# EAGLE design dsplolo (EAGLE 8.0.0)

## Sheet 1 of 2
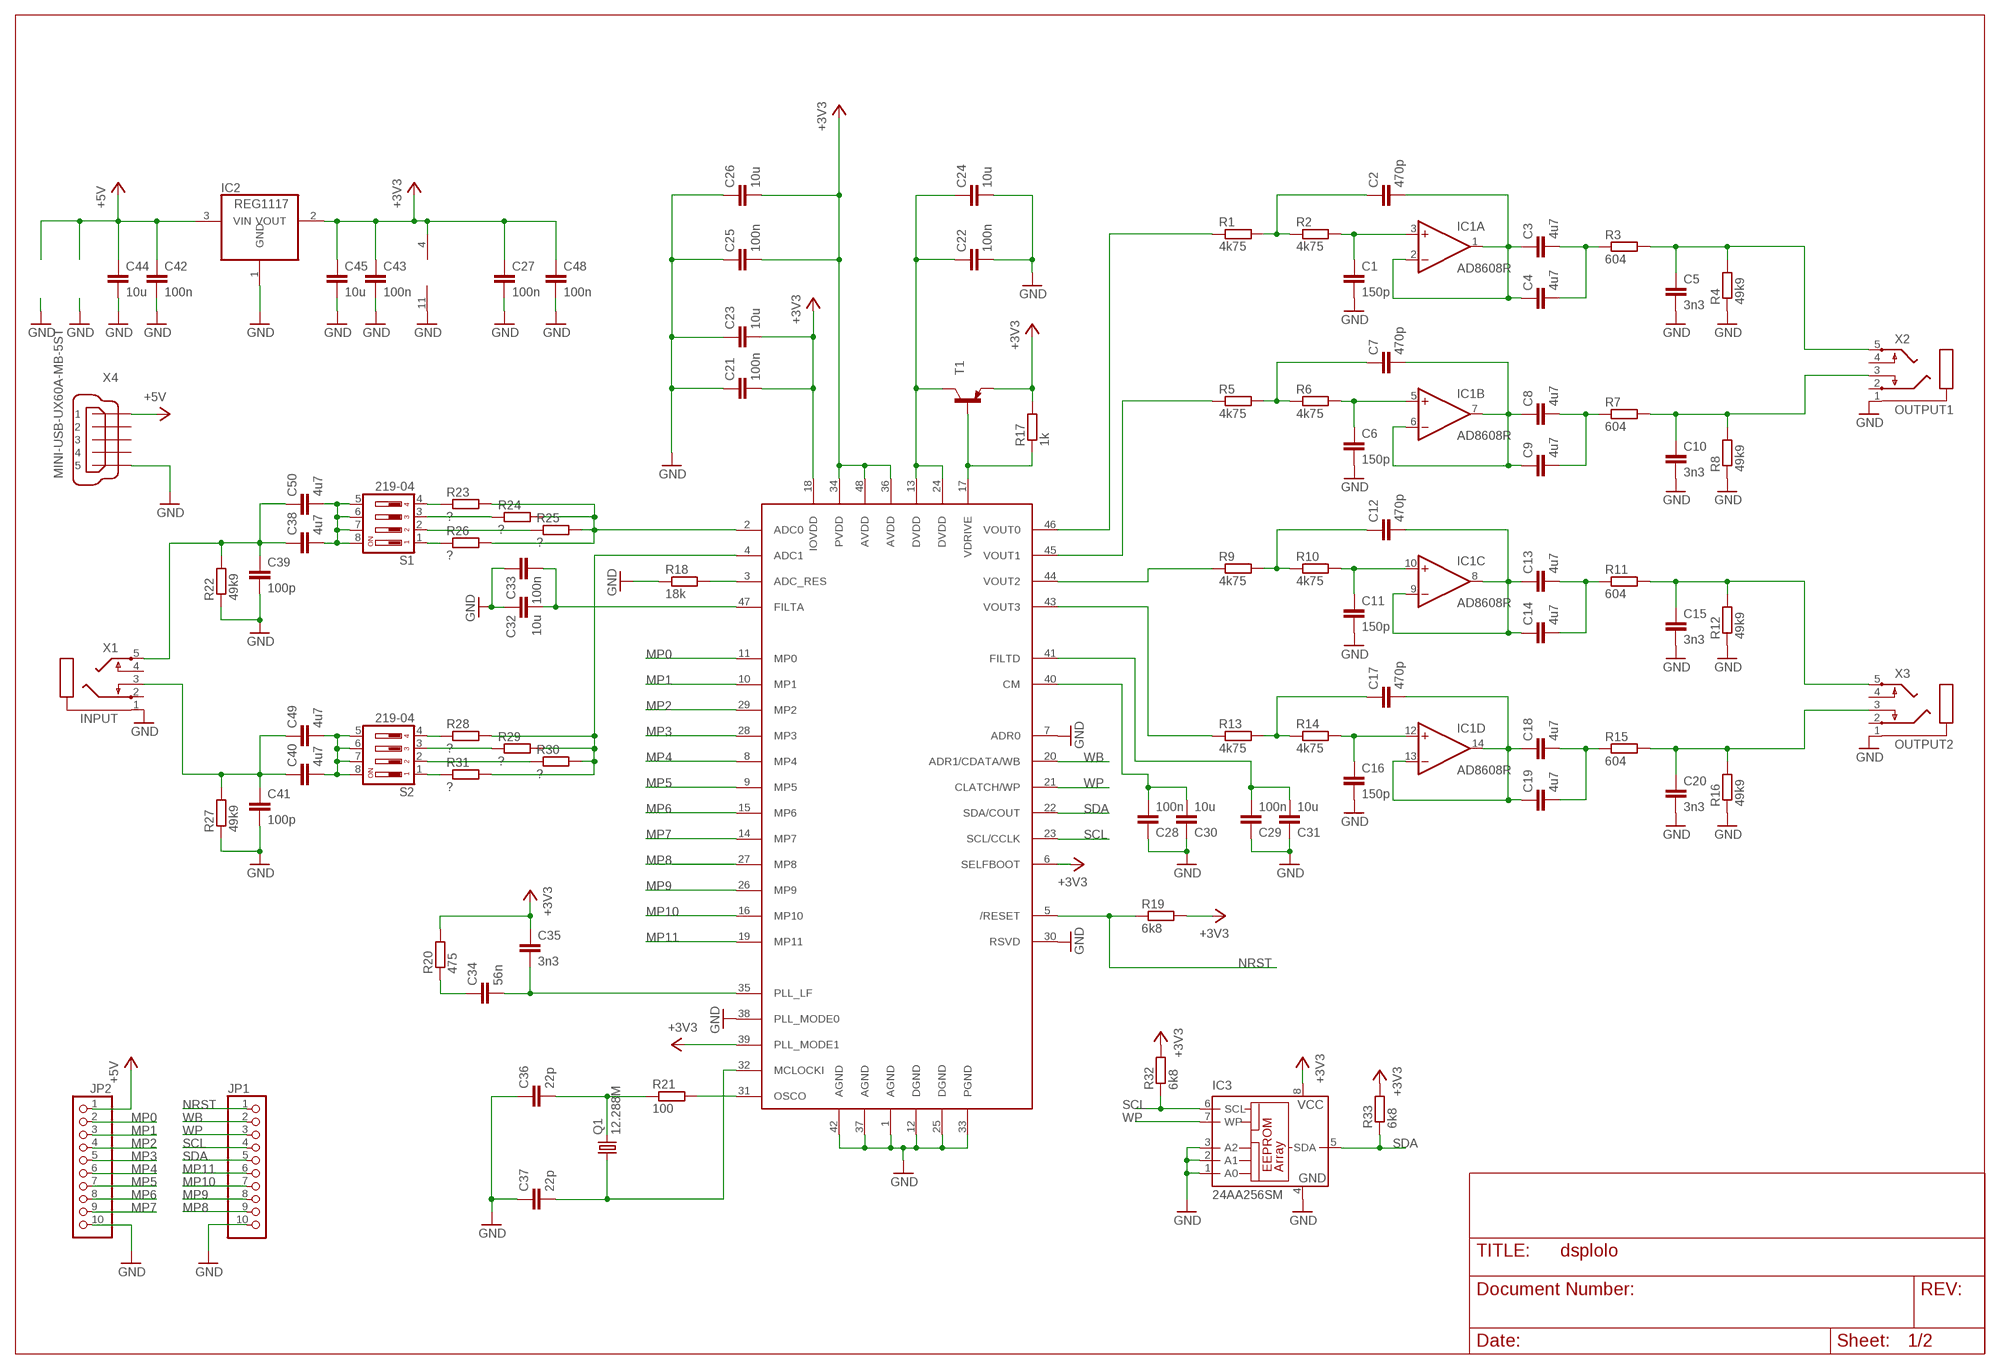
[diagram p0: schematic, sheet 1]

### Parts
C1  150p  C-EUC1206  [C1206]
C2  470p  C-EUC1206  [C1206]
C3  4u7  C-EUC1206  [C1206]
C4  4u7  C-EUC1206  [C1206]
C5  3n3  C-EUC1206  [C1206]
C6  150p  C-EUC1206  [C1206]
C7  470p  C-EUC1206  [C1206]
C8  4u7  C-EUC1206  [C1206]
C9  4u7  C-EUC1206  [C1206]
C10  3n3  C-EUC1206  [C1206]
C11  150p  C-EUC1206  [C1206]
C12  470p  C-EUC1206  [C1206]
C13  4u7  C-EUC1206  [C1206]
C14  4u7  C-EUC1206  [C1206]
C15  3n3  C-EUC1206  [C1206]
C16  150p  C-EUC1206  [C1206]
C17  470p  C-EUC1206  [C1206]
C18  4u7  C-EUC1206  [C1206]
C19  4u7  C-EUC1206  [C1206]
C20  3n3  C-EUC1206  [C1206]
C21  100n  C-EUC1206  [C1206]
C22  100n  C-EUC1206  [C1206]
C23  10u  C-EUC1206  [C1206]
C24  10u  C-EUC1206  [C1206]
C25  100n  C-EUC1206  [C1206]
C26  10u  C-EUC1206  [C1206]
C27  100n  C-EUC1206  [C1206]
C28  100n  C-EUC1206  [C1206]
C29  100n  C-EUC1206  [C1206]
C30  10u  C-EUC1206  [C1206]
C31  10u  C-EUC1206  [C1206]
C32  10u  C-EUC1206  [C1206]
C33  100n  C-EUC1206  [C1206]
C34  56n  C-EUC1206  [C1206]
C35  3n3  C-EUC1206  [C1206]
C36  22p  C-EUC1206  [C1206]
C37  22p  C-EUC1206  [C1206]
C38  4u7  C-EUC1206  [C1206]
C39  100p  C-EUC1206  [C1206]
C40  4u7  C-EUC1206  [C1206]
C41  100p  C-EUC1206  [C1206]
C42  100n  C-EUC1206  [C1206]
C43  100n  C-EUC1206  [C1206]
C44  10u  C-EUC1206  [C1206]
C45  10u  C-EUC1206  [C1206]
C48  100n  C-EUC1206  [C1206]
C49  4u7  C-EUC1206  [C1206]
C50  4u7  C-EUC1206  [C1206]
IC1  AD8608R  [SO-14]
IC2  REG1117  [SOT223]
IC3  24AA256SM  24AA128SM  [SO-08M]
JP1  PINHD-1X10  [1X10]
JP2  PINHD-1X10  [1X10]
Q1  12.288M  CRYSTALHC49UP  [HC49UP]
R1  4k75  R-EU_R1206  [R1206]
R2  4k75  R-EU_R1206  [R1206]
R3  604  R-EU_R1206  [R1206]
R4  49k9  R-EU_R1206  [R1206]
R5  4k75  R-EU_R1206  [R1206]
R6  4k75  R-EU_R1206  [R1206]
R7  604  R-EU_R1206  [R1206]
R8  49k9  R-EU_R1206  [R1206]
R9  4k75  R-EU_R1206  [R1206]
R10  4k75  R-EU_R1206  [R1206]
R11  604  R-EU_R1206  [R1206]
R12  49k9  R-EU_R1206  [R1206]
R13  4k75  R-EU_R1206  [R1206]
R14  4k75  R-EU_R1206  [R1206]
R15  604  R-EU_R1206  [R1206]
R16  49k9  R-EU_R1206  [R1206]
R17  1k  R-EU_R1206  [R1206]
R18  18k  R-EU_R1206  [R1206]
R19  6k8  R-EU_R1206  [R1206]
R20  475  R-EU_R1206  [R1206]
R21  100  R-EU_R1206  [R1206]
R22  49k9  R-EU_R1206  [R1206]
R23  ?  R-EU_R1206  [R1206]
R24  ?  R-EU_R1206  [R1206]
R25  ?  R-EU_R1206  [R1206]
R26  ?  R-EU_R1206  [R1206]
R27  49k9  R-EU_R1206  [R1206]
R28  ?  R-EU_R1206  [R1206]
R29  ?  R-EU_R1206  [R1206]
R30  ?  R-EU_R1206  [R1206]
R31  ?  R-EU_R1206  [R1206]
R32  6k8  R-EU_R1206  [R1206]
R33  6k8  R-EU_R1206  [R1206]
S1  219-04  [CTS-219-04]
S2  219-04  [CTS-219-04]
T1  BC857C-PNP-SOT23-BEC  [SOT23-BEC]
U$1  ADAU1701  [LQFP-48]
X1  INPUT  STEREOJACK  [STX3100]
X2  OUTPUT1  STEREOJACK  [STX3100]
X3  OUTPUT2  STEREOJACK  [STX3100]
X4  MINI-USB-UX60A-MB-5ST  [UX60A-MB-5ST]

### Nets
+3V3: C21.2 C23.2 C25.2 C26.2 C27.1 C35.1 C43.1 C45.1 C48.1 IC1.4(V+) IC2.2(VOUT) IC3.8(VCC) R17.2 R19.2 R20.2 R32.2 R33.2 T1.E U$1.6(SELFBOOT) U$1.18(IOVDD) U$1.34(PVDD) U$1.36(AVDD) U$1.39(PLL_MODE1) U$1.48(AVDD)
+5V: C42.1 C44.1 IC2.3(VIN) JP2.1 X4.1
GND: C1.2 C5.2 C6.2 C10.2 C11.2 C15.2 C16.2 C20.2 C21.1 C22.2 C23.1 C24.2 C25.1 C26.1 C27.2 C28.1 C29.1 C30.1 C31.1 C32.1 C33.1 C36.1 C37.1 C39.2 C41.2 C42.2 C43.2 C44.2 C45.2 C48.2 IC1.11(V-) IC2.1(GND) IC3.1(A0) IC3.2(A1) IC3.3(A2) IC3.4(GND) JP1.10 JP2.10 R4.1 R8.1 R12.1 R16.1 R18.1 R22.1 R27.1 U$1.1(AGND) U$1.7(ADR0) U$1.12(DGND) U$1.25(DGND) U$1.30(RSVD) U$1.33(PGND) U$1.37(AGND) U$1.38(PLL_MODE0) U$1.42(AGND) X1.1 X2.1 X3.1 X4.5
MP0: JP2.2 U$1.11(MP0)
MP1: JP2.3 U$1.10(MP1)
MP2: JP2.4 U$1.29(MP2)
MP3: JP2.5 U$1.28(MP3)
MP4: JP2.6 U$1.8(MP4)
MP5: JP2.7 U$1.9(MP5)
MP6: JP2.8 U$1.15(MP6)
MP7: JP2.9 U$1.14(MP7)
MP8: JP1.9 U$1.27(MP8)
MP9: JP1.8 U$1.26(MP9)
MP10: JP1.7 U$1.16(MP10)
MP11: JP1.6 U$1.19(MP11)
N$1: C8.2 C9.2 R7.1
N$2: C3.2 C4.2 R3.1
N$3: C5.1 R3.2 R4.2 X2.5
N$4: C2.1 R1.2 R2.1
N$5: C1.1 IC1.3(A:+IN) R2.2
N$6: C2.2 C3.1 C4.1 IC1.1(A:OUT) IC1.2(A:-IN)
N$7: C10.1 R7.2 R8.2 X2.3
N$8: C7.1 R5.2 R6.1
N$9: C6.1 IC1.5(B:+IN) R6.2
N$10: C7.2 C8.1 C9.1 IC1.6(B:-IN) IC1.7(B:OUT)
N$11: C13.2 C14.2 R11.1
N$12: C15.1 R11.2 R12.2 X3.5
N$13: C12.1 R9.2 R10.1
N$14: C11.1 IC1.10(C:+IN) R10.2
N$15: C12.2 C13.1 C14.1 IC1.8(C:OUT) IC1.9(C:-IN)
N$16: C18.2 C19.2 R15.1
N$17: C20.1 R15.2 R16.2 X3.3
N$18: C17.1 R13.2 R14.1
N$19: C16.1 IC1.12(D:+IN) R14.2
N$20: C17.2 C18.1 C19.1 IC1.13(D:-IN) IC1.14(D:OUT)
N$21: R18.2 U$1.3(ADC_RES)
N$22: C22.1 C24.1 T1.C U$1.13(DVDD) U$1.24(DVDD)
N$23: R17.1 T1.B U$1.17(VDRIVE)
N$24: R1.1 U$1.46(VOUT0)
N$25: R5.1 U$1.45(VOUT1)
N$26: R9.1 U$1.44(VOUT2)
N$27: R13.1 U$1.43(VOUT3)
N$28: C32.2 C33.2 U$1.47(FILTA)
N$29: C37.2 Q1.1 U$1.32(MCLOCKI)
N$30: C29.2 C31.2 U$1.41(FILTD)
N$31: C28.2 C30.2 U$1.40(CM)
N$32: C34.2 C35.2 U$1.35(PLL_LF)
N$33: C34.1 R20.1
N$34: C36.2 Q1.2 R21.1
N$35: R21.2 U$1.31(OSCO)
N$36: R23.1 S1.4
N$37: C38.1 C39.1 C50.1 R22.2 X1.5
N$38: C38.2 C50.2 S1.5 S1.6 S1.7 S1.8
N$39: R24.1 S1.3
N$40: R25.1 S1.2
N$41: R26.1 S1.1
N$42: R23.2 R24.2 R25.2 R26.2 U$1.2(ADC0)
N$44: C40.1 C41.1 C49.1 R27.2 X1.3
N$45: C40.2 C49.2 S2.5 S2.6 S2.7 S2.8
N$46: R28.1 S2.4
N$47: R29.1 S2.3
N$48: R30.1 S2.2
N$49: R31.1 S2.1
N$50: R28.2 R29.2 R30.2 R31.2 U$1.4(ADC1)
NRST: JP1.1 R19.1 U$1.5(/RESET)
SCL: IC3.6(SCL) JP1.4 R32.1 U$1.23(SCL/CCLK)
SDA: IC3.5(SDA) JP1.5 R33.1 U$1.22(SDA/COUT)
WB: JP1.2 U$1.20(ADR1/CDATA/WB)
WP: IC3.7(WP) JP1.3 U$1.21(CLATCH/WP)
Unconnected: X1.2 X1.4 X2.2 X2.4 X3.2 X3.4 X4.2 X4.3 X4.4

## Sheet 2 of 2
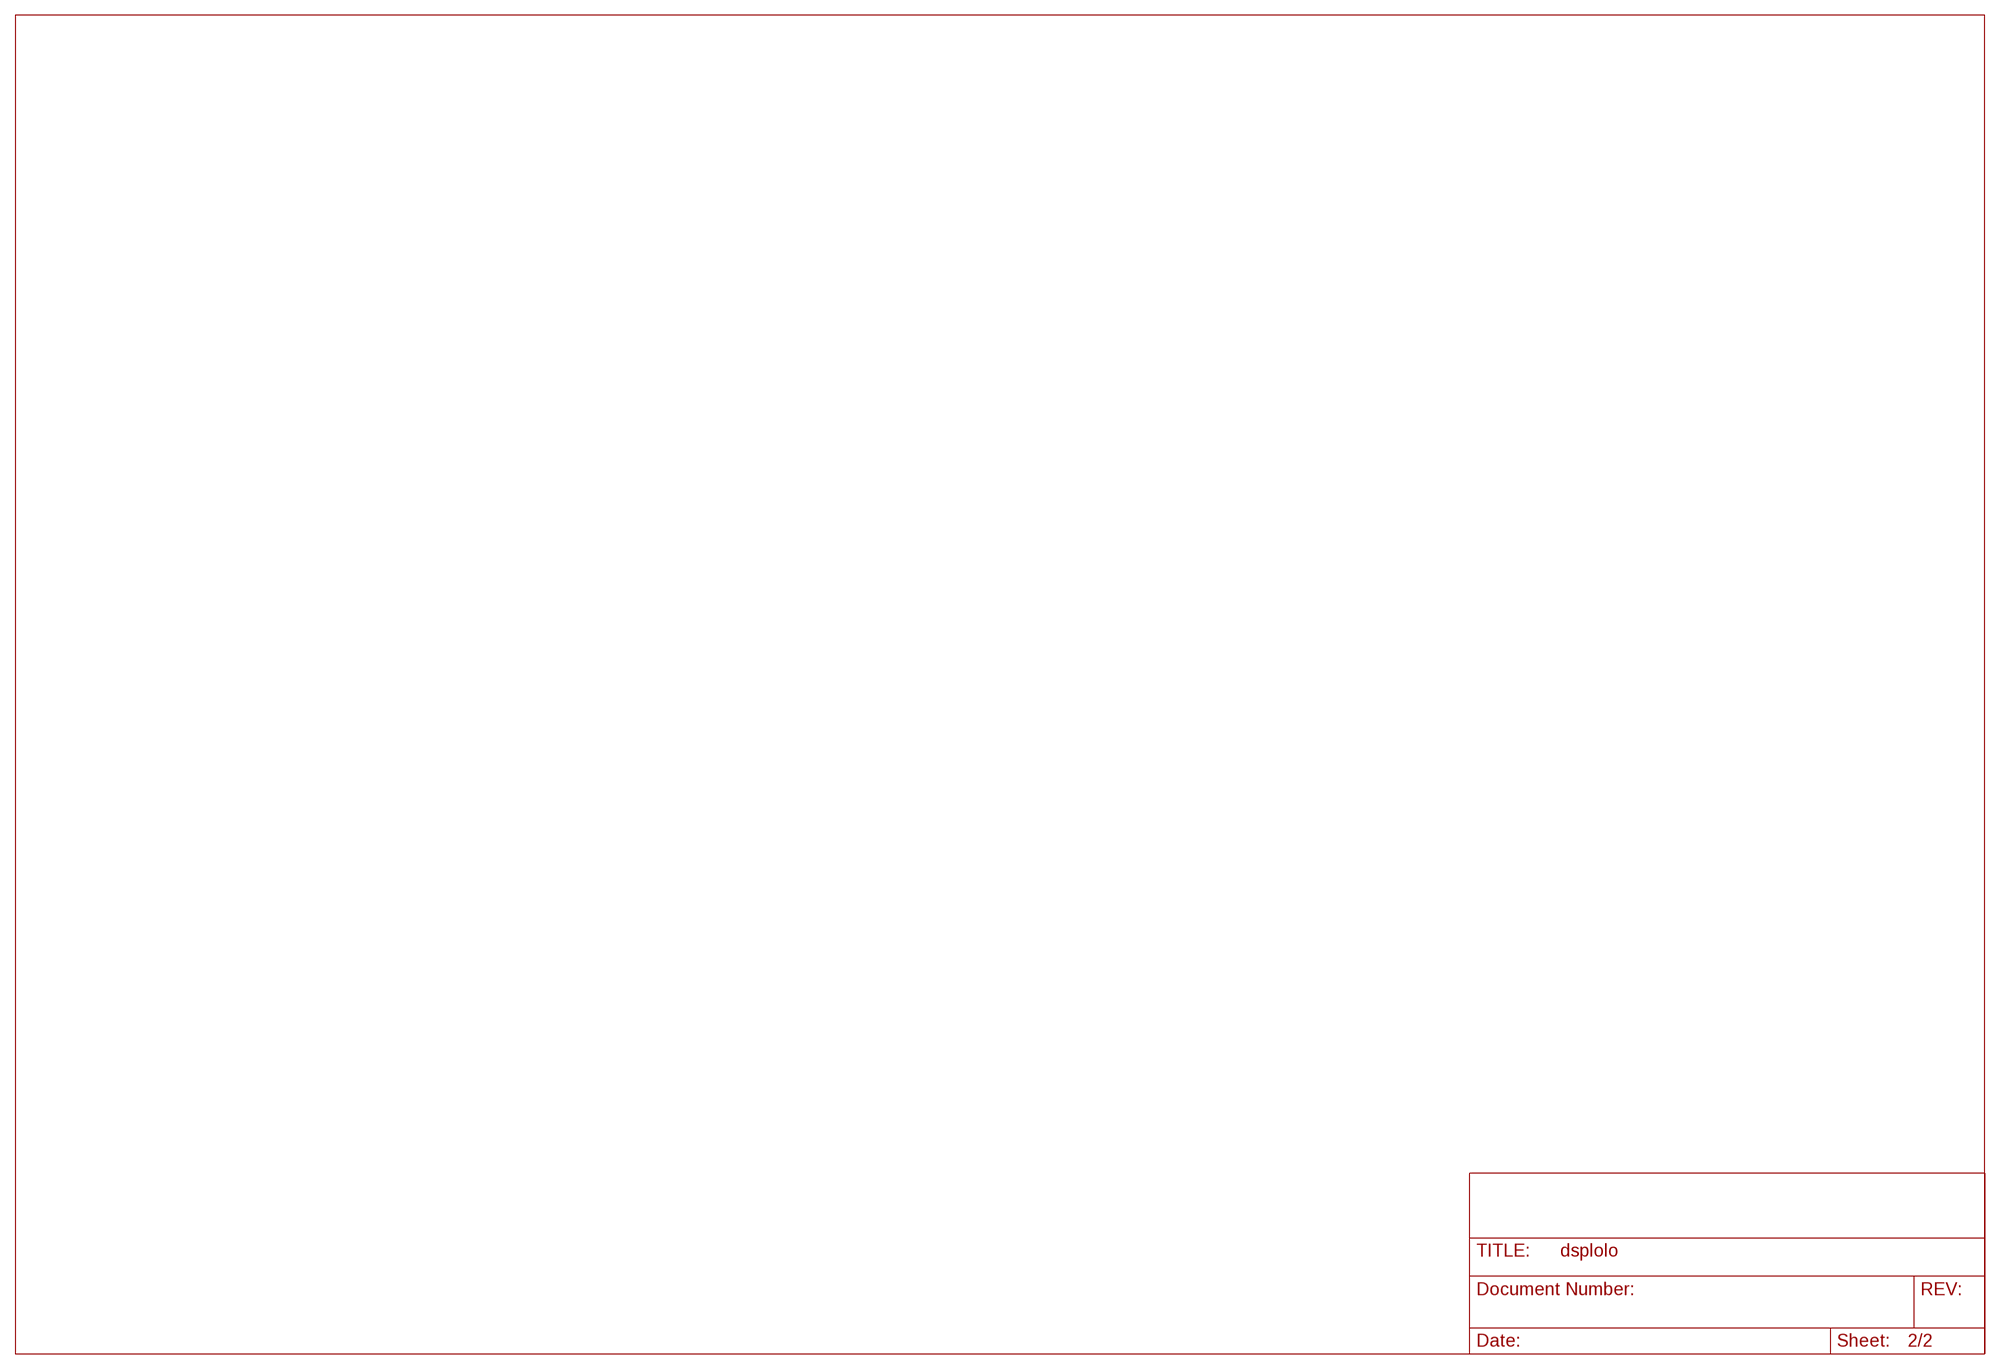
[diagram p1: schematic, sheet 2]

## Library data of the parts
C1-C20 = rcl:C-EU: CAPACITOR, European symbol
C21-C45 C48-C50 = resistor:C-EU: CAPACITOR, European symbol
IC1 = 0-ADI-variety:AD8608*
IC2 = burr-brown:REG1117: 800mA and 1A Low Dropout (LDO) Positive Regulator 1.8V, 2.5V, 2.85V, 3.3V, 5V, and Adj; MPN: REG1117; OC_FARNELL: 1097566; OC_NEWARK: 14P6981
IC3 = microchip:24*: Serial EEPROM I2C; MF: MICROCHIP; MPN: 24AA128-I/MS; OC_FARNELL: 1331285; OC_NEWARK: 92C6839
JP1 JP2 = pinhead:PINHD-1X10: PIN HEADER
Q1 = crystal:CRYSTAL: CRYSTAL; OC_FARNELL: unknown; OC_NEWARK: unknown
R1-R33 = rcl:R-EU_: RESISTOR, European symbol
S1 S2 = switch-dil:219-04*: Surface Mount DIP Switch Series 219 SMT CTS Electronic Components Sourc: www.ctscorp.com; OC_FARNELL: unknown; OC_NEWARK: unknown
T1 = transistor:*-PNP-: PNP Transistror
U$1 = analog-devices_2:ADAU1701
X1-X3 = adafruit:STEREOJACK: MIC/HEADPHONE JACK Stereo jack with two switches. Kycon STX3100, CUI SJ1-3555NG and/or 4UCon 05544
X4 = con-hirose:MINI-USB-: MINI USB Connector Source: http://www.hirose.co.jp/cataloge_hp/e24000019.pdf; OC_FARNELL: unknown; OC_NEWARK: unknown

## Board
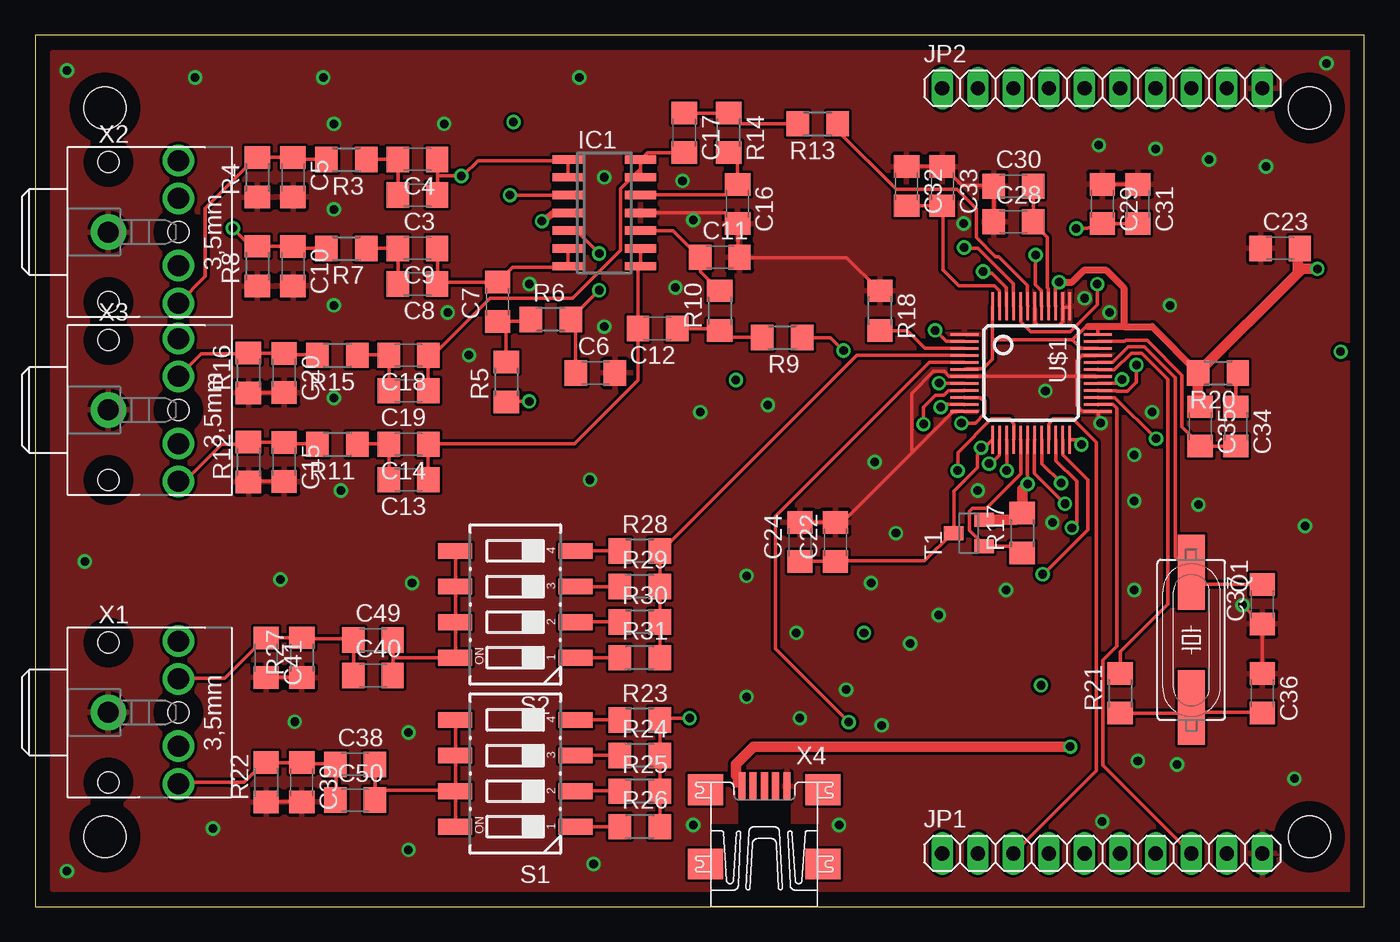
[diagram p2: board, top side]
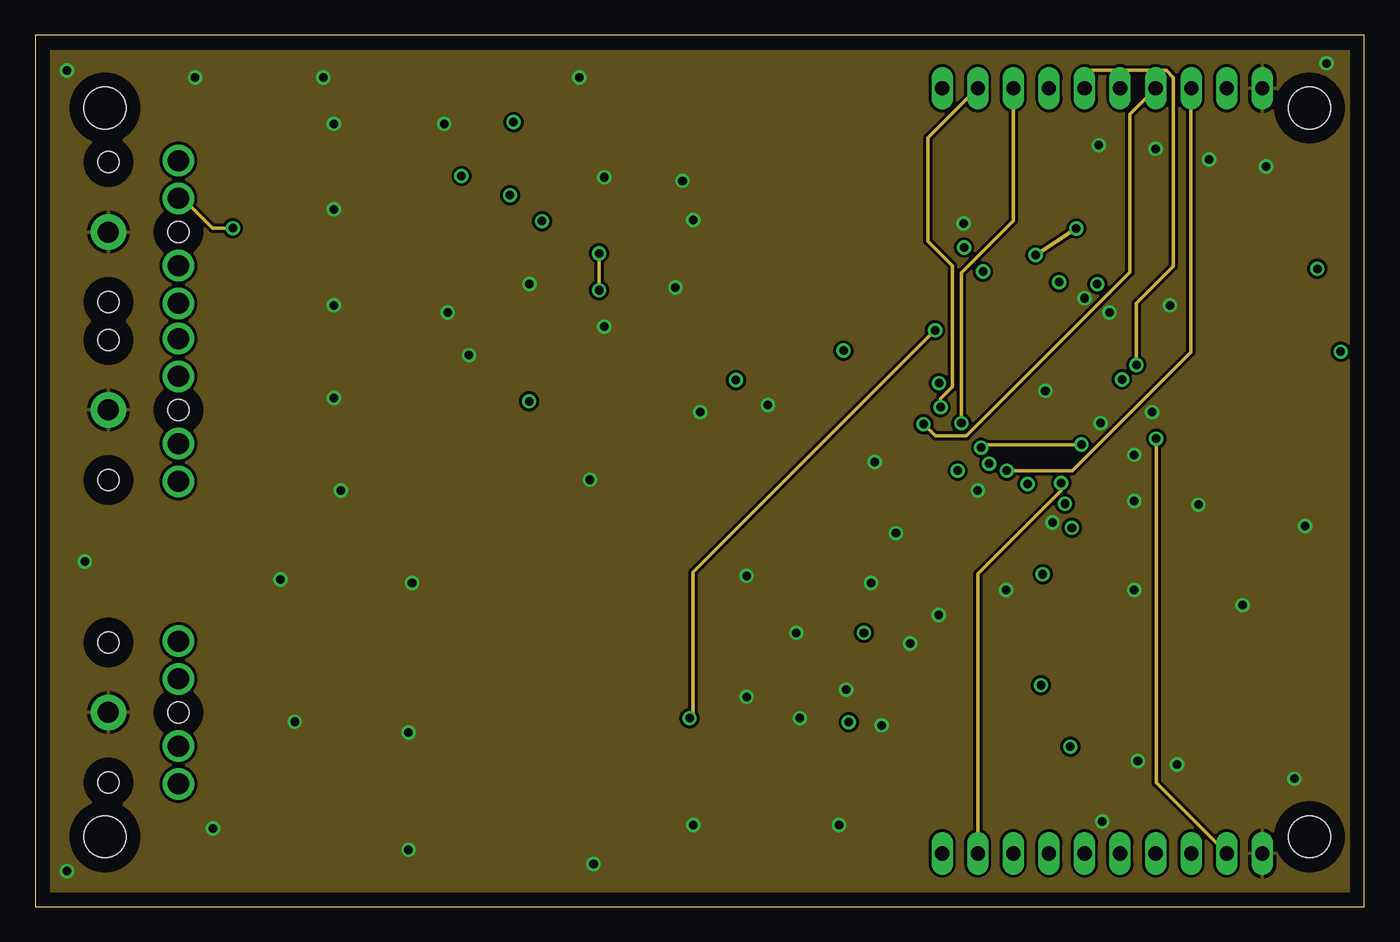
[diagram p3: board, inner layer Route2]
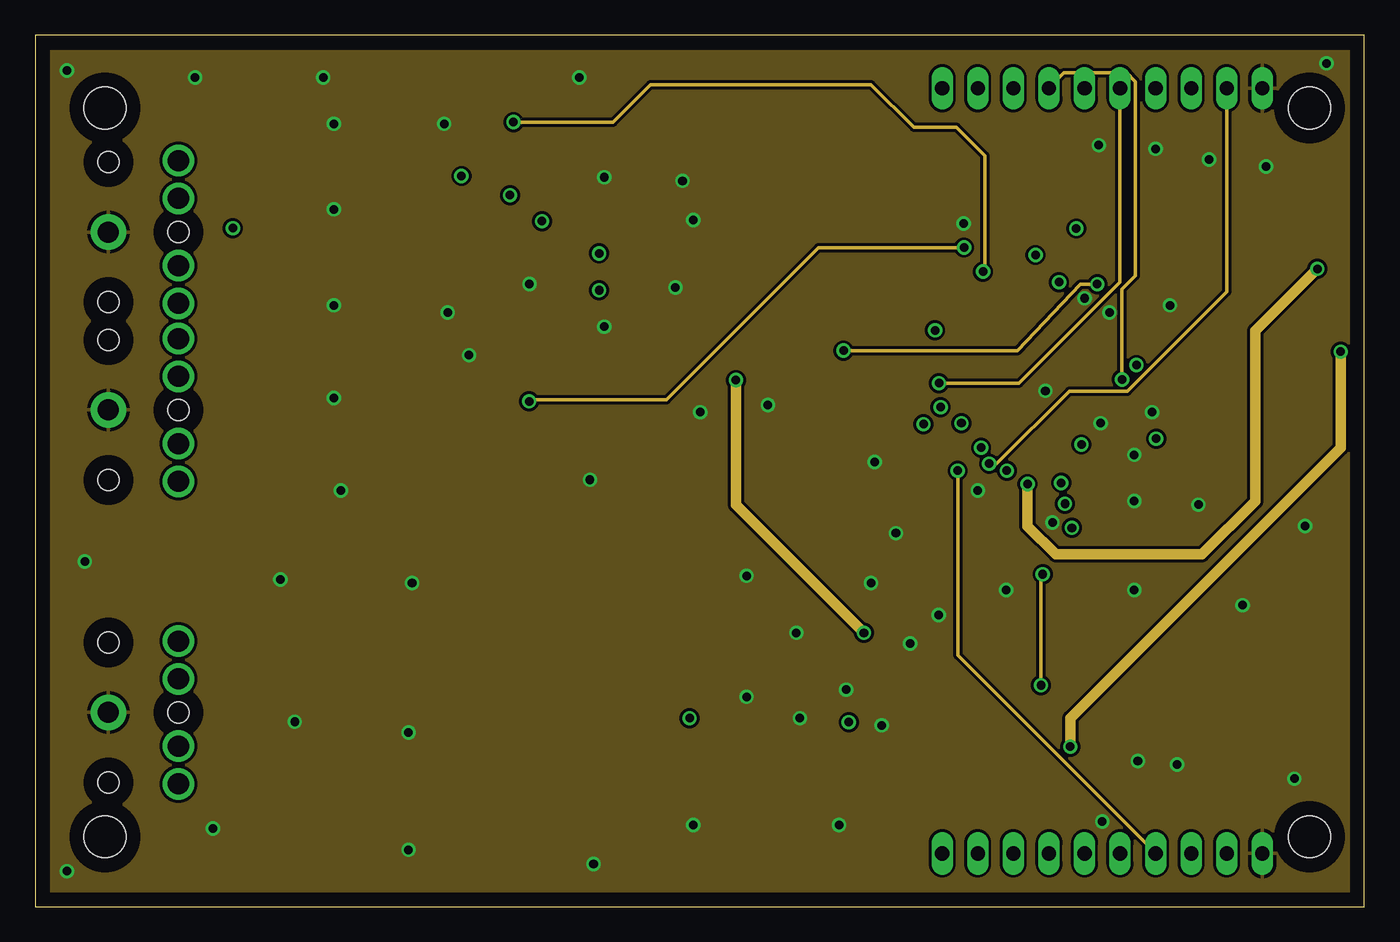
[diagram p4: board, inner layer Route15]
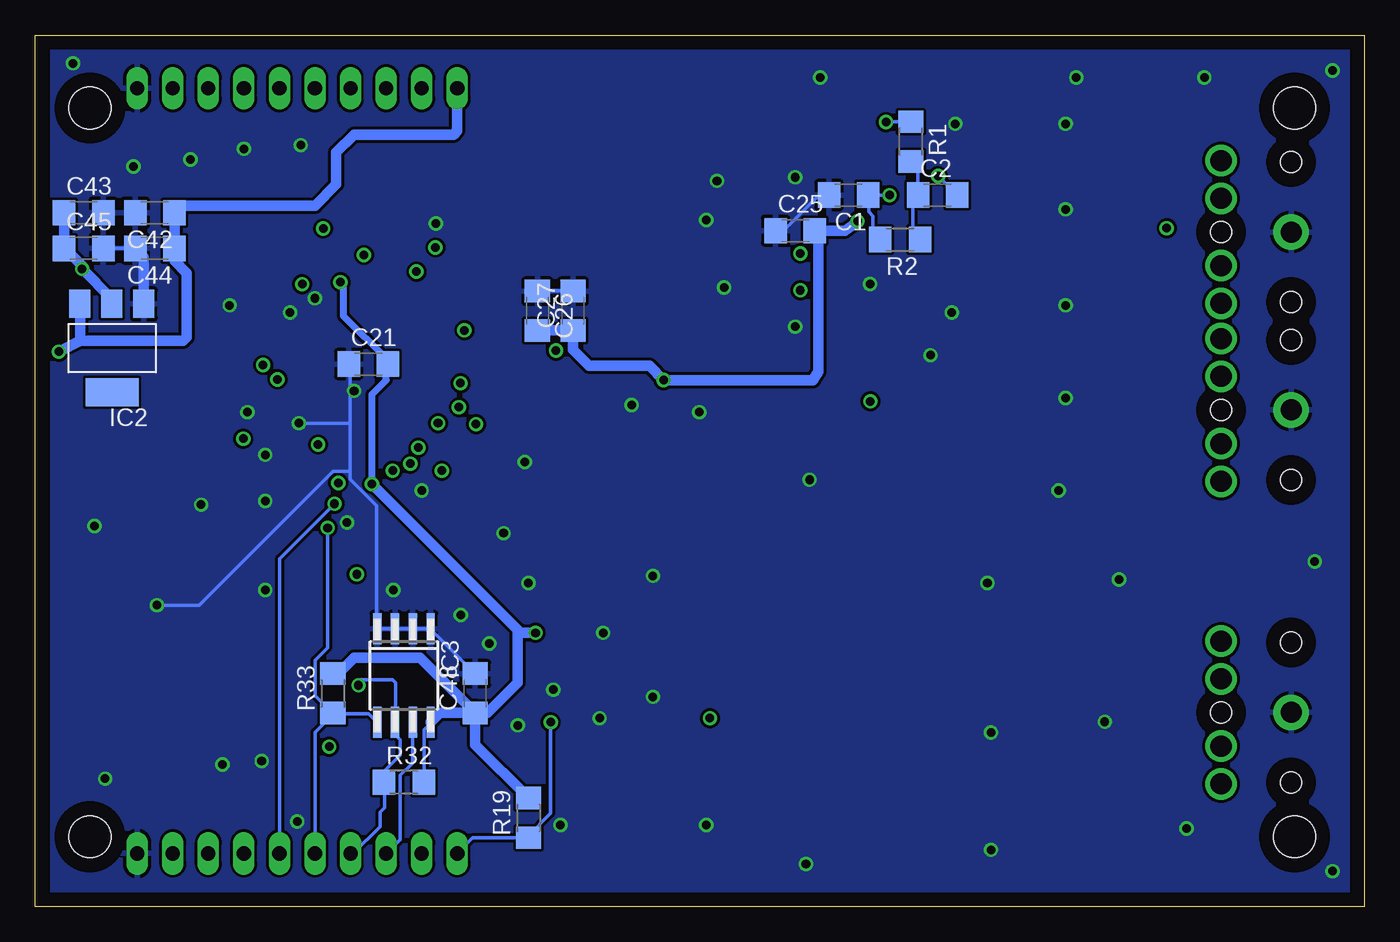
[diagram p5: board, bottom side, seen from below]

Size 94.92 x 62.22 mm. Coordinates in mm from the lower left corner, seen from the top.
Outline: 0,0 94.92,0 94.92,62.22 0,62.22 0,0
Copper layers (1*2*15*16): Top 0.018mm / dielectric 0.2mm / Route2 0.018mm / dielectric 1mm / Route15 0.018mm / dielectric 0.2mm / Bottom 0.018mm
Design rules "default *": minimum track width 10mil, minimum drill 24mil, track to track 8mil, track to pad 8mil, pad to pad 8mil, via to via 8mil, smd to smd 8mil, copper to edge 40mil, drill to drill 8mil, minimum pad ring 10mil, minimum via ring 8mil, stop-mask expansion 4mil, vias tented up to drill 0mil, thermal gap 10mil
Holes 3 mm at 5,5 5,57 91,57 91,5

### Footprints (pad centres in the part's own frame; a part is rotated, then mirrored left to right if it is on the bottom)
C1206 = smd 1.6 x 1.8: 1 -1.4,0; 2 1.4,0
SO-14 = smd 0.6 x 2.2: 1 -3.81,-2.6; 2 -2.54,-2.6; 3 -1.27,-2.6; 4 0,-2.6; 5 1.27,-2.6; 6 2.54,-2.6; 7 3.81,-2.6; 8 3.81,2.6; 9 2.54,2.6; 10 1.27,2.6; 11 0,2.6; 12 -1.27,2.6; 13 -2.54,2.6; 14 -3.81,2.6
SOT223 = smd 1.499 x 2.007: 1 -2.261,-3.15; 2 0.025,-3.15; 3 2.311,-3.15 | smd 3.81 x 2.007: 4 0,3.15
SO-08M = smd 0.6 x 2.2: 1 -1.905,-3.33; 2 -0.635,-3.33; 3 0.635,-3.33; 4 1.905,-3.33; 5 1.905,3.33; 6 0.635,3.33; 7 -0.635,3.33; 8 -1.905,3.33
1X10 = drill 1.016 long: 1 -11.43,0; 2 -8.89,0; 3 -6.35,0; 4 -3.81,0; 5 -1.27,0; 6 1.27,0; 7 3.81,0; 8 6.35,0; 9 8.89,0; 10 11.43,0
HC49UP = smd 5.334 x 1.93: 1 -4.826,0; 2 4.826,0
R1206 = smd 1.6 x 1.803: 1 -1.422,0; 2 1.422,0
CTS-219-04 = smd 1.13 x 2.44: 1 -3.81,-4.3; 2 -1.27,-4.3; 3 1.27,-4.3; 4 3.81,-4.3; 5 3.81,4.3; 6 1.27,4.3; 7 -1.27,4.3; 8 -3.81,4.3
SOT23-BEC = smd 1 x 1.4: B -0.95,-1.1; C 0,1.1; E 0.95,-1.1
LQFP-48 = smd 0.2 x 2: 1 -2.75,-4.75; 2 -2.25,-4.75; 3 -1.75,-4.75; 4 -1.25,-4.75; 5 -0.75,-4.75; 6 -0.25,-4.75; 7 0.25,-4.75; 8 0.75,-4.75; 9 1.25,-4.75; 10 1.75,-4.75; 11 2.25,-4.75; 12 2.75,-4.75; 25 2.75,4.75; 26 2.25,4.75; 27 1.75,4.75; 28 1.25,4.75; 29 0.75,4.75; 30 0.25,4.75; 31 -0.25,4.75; 32 -0.75,4.75; 33 -1.25,4.75; 34 -1.75,4.75; 35 -2.25,4.75; 36 -2.75,4.75 | smd 2 x 0.2: 13 4.75,-2.75; 14 4.75,-2.25; 15 4.75,-1.75; 16 4.75,-1.25; 17 4.75,-0.75; 18 4.75,-0.25; 19 4.75,0.25; 20 4.75,0.75; 21 4.75,1.25; 22 4.75,1.75; 23 4.75,2.25; 24 4.75,2.75; 37 -4.75,2.75; 38 -4.75,2.25; 39 -4.75,1.75; 40 -4.75,1.25; 41 -4.75,0.75; 42 -4.75,0.25; 43 -4.75,-0.25; 44 -4.75,-0.75; 45 -4.75,-1.25; 46 -4.75,-1.75; 47 -4.75,-2.25; 48 -4.75,-2.75
STX3100 = drill 1.5 pad 2.54: 1 2.7,-0.1 | drill 1.5: 2 7.7,5; 3 7.7,2.3; 4 7.7,-2.5; 5 7.7,-5.2 | hole 1.5: 2.7,4.9; 2.7,-5.1; 7.7,-0.1
UX60A-MB-5ST = smd 2 x 0.5: 1 2.25,1.6; 2 2.25,0.8; 3 2.25,0; 4 2.25,-0.8; 5 2.25,-1.6 | smd 2.2 x 2.5: M1 -3.3,-4.2; M2 -3.3,4.2; M3 2,4.2; M4 2,-4.2

### Placement (x,y rotation side)
C1  36.83,50.8 180 bottom
C2  30.48,50.8 0 bottom
C3  27.3,50.8 180 top
C4  27.3,53.34 180 top
C5  18.41,52.07 270 top
C6  40.01,38.1 0 top
C7  33.02,43.18 90 top
C8  27.3,44.45 180 top
C9  27.3,46.99 180 top
C10  18.41,45.72 270 top
C11  48.9,46.35 0 top
C12  44.45,41.27 180 top
C13  26.67,30.48 180 top
C14  26.67,33.02 180 top
C15  17.78,31.75 270 top
C16  50.16,50.16 270 top
C17  46.35,55.24 270 top
C18  26.67,39.37 180 top
C19  26.67,36.83 180 top
C20  17.78,38.1 270 top
C21  71.12,38.73 0 bottom
C22  57.15,26.04 90 top
C23  88.9,46.99 0 top
C24  54.61,26.04 90 top
C25  40.64,48.26 0 bottom
C26  59.05,42.55 270 bottom
C27  56.52,42.55 90 bottom
C28  69.85,48.9 0 top
C29  76.2,50.16 270 top
C30  69.85,51.44 0 top
C31  78.74,50.16 270 top
C32  62.23,51.44 270 top
C33  64.77,51.44 270 top
C34  85.72,34.29 270 top
C35  83.19,34.29 270 top
C36  87.63,15.24 270 top
C37  87.63,21.59 90 top
C38  22.86,10.16 0 top
C39  19.05,8.89 270 top
C40  24.13,16.51 0 top
C41  16.51,17.78 270 top
C42  86.36,49.53 180 bottom
C43  91.44,49.53 0 bottom
C44  86.36,46.99 180 bottom
C45  91.44,46.99 0 bottom
C48  63.5,15.24 90 bottom
C49  24.13,19.05 0 top
C50  22.86,7.62 0 top
IC1  40.64,49.53 270 top
IC2  89.41,39.88 180 bottom
IC3  68.58,16.51 180 bottom
JP1  76.2,3.81 0 top
JP2  76.2,58.42 0 top
Q1  82.55,19.05 270 top
R1  32.38,54.61 270 bottom
R2  33.15,47.62 180 bottom
R3  22.23,53.34 180 top
R4  15.88,52.07 90 top
R5  33.66,37.47 90 top
R6  36.83,41.91 0 top
R7  22.23,46.99 180 top
R8  15.88,45.72 90 top
R9  53.34,40.64 180 top
R10  48.9,42.55 90 top
R11  21.59,33.02 180 top
R12  15.24,31.75 90 top
R13  55.88,55.88 180 top
R14  49.53,55.24 270 top
R15  21.59,39.37 180 top
R16  15.24,38.1 90 top
R17  70.48,26.67 90 top
R18  60.33,42.55 270 top
R19  59.69,6.35 90 bottom
R20  84.45,38.1 180 top
R21  77.47,15.24 90 top
R22  16.51,8.89 90 top
R23  43.18,13.34 0 top
R24  43.18,10.79 0 top
R25  43.18,8.26 0 top
R26  43.18,5.71 0 top
R27  19.05,17.78 90 top
R28  43.18,25.4 0 top
R29  43.18,22.86 0 top
R30  43.18,20.32 0 top
R31  43.18,17.78 0 top
R32  68.58,8.89 0 bottom
R33  73.66,15.24 90 bottom
S1  34.29,9.53 90 top
S2  34.29,21.59 90 top
T1  66.67,26.67 90 top
U$1  71.12,38.1 270 top
X1  2.54,13.97 0 top
X2  2.54,48.26 0 top
X3  2.54,35.56 0 top
X4  52.07,6.35 90 top

### Tracks (layer width: path | path; a pad name or v marks a point on that pad's centre or on a via)
+3V3  (via drill 0.61)
  Top 0.254: 83.17,35.7 C35.1 | 83.06,38.1 R20.2 | 90.3,46.98 C23.2 | 70.03,27.62 R17.2 70.56,28.19 | T1.E | v70.87,30.18 70.87,33.34 U$1.18 | 38.02,49.53 IC1.4 | v73.11,44.58 72.85,44.31 72.85,42.86 U$1.39 | 75.89,41.4 75.89,40.92 U$1.36 | 68.35,40.46 68.35,42.75 U$1.48 | 68.35,40.46 68.35,39.09 67.67,38.41 66.52,38.41 U$1.6 | 74.07,40.46 74.98,41.38 75.18,41.4 | 68.35,40.46 74.07,40.46 | U$1.34 74.68,39.85 74.07,40.46
  Top 0.508: IC1.4 37.05,49.53 v36.2,48.93 | R20.2 83.03,38.12 79.76,41.4 77.72,41.4 | 77.72,41.4 75.89,41.4 75.18,41.4 | v73.11,44.58 74.04,44.58 74.93,45.47 76.45,45.47 77.72,44.2 77.72,41.4
  Top 0.762: v70.87,30.18 70.48,29.79 R17.2 70.01,27.62 T1.E | C35.1 83.03,35.84 R20.2 90.16,45.22 | 90.16,45.22 90.46,45.53 v91.55,45.53 | C23.2 90.16,46.85 90.16,45.22
  Route15 0.762: v91.55,45.53 87.12,41.1 87.12,28.96 83.31,25.15 72.9,25.15 70.87,27.18 v70.87,30.18 | v59.18,19.56 50.04,28.7 v50.04,37.59
  Bottom 0.254: 92.85,47.02 C45.1 92.73,46.94 | C43.1 | 89,43.81 88.92,43.81 IC2.2 | R32.2 67.13,8.91 67.13,12.65 66.71,13.07 IC3.8 | 39.2,48.27 C25.2 39.24,48.16 | 56.54,41.15 C27.1 56.43,41.07 | 58.94,41.15 C26.2 | 69.8,38.82 C21.2 69.73,38.72 69.8,38.63 | 63.44,14.52 63.44,13.95 C48.1 | 70.83,30.06 v70.87,30.18
  Bottom 0.508: 69.8,38.82 69.8,39.06 72.9,42.16 72.9,44.36 v73.11,44.58 | v70.87,30.18 70.87,36.58 69.85,37.59 69.85,38.6 69.73,38.72
  Bottom 0.762: R33.2 73.25,16.66 72.14,17.78 67.44,17.78 C48.1 | C48.1 66.02,13.84 IC3.8 | C48.1 63.5,11.58 R19.2 | C48.1 62.61,13.84 60.45,16 60.45,19.76 | 60.45,19.76 v70.87,30.18 | 92.73,46.94 91.55,45.76 v91.55,45.53 89.43,43.41 IC2.2 | 60.45,19.76 60.25,19.56 v59.18,19.56 | C26.2 C27.1 56.52,39.75 55.37,38.61 51.05,38.61 v50.04,37.59 39.37,37.59 38.99,38.22 38.99,48.01 C25.2 37.08,48.26 36.2,48.9 v36.2,48.93 | C43.1 C45.1
+5V  (via drill 0.61)
  Top 0.508: 50.04,9.4 50.04,8.78 X4.1
  Top 0.762: v73.91,11.43 51.31,11.43 50.04,10.16 50.04,9.4
  Route15 0.762: v73.91,11.43 73.91,13.46 93.22,32.77 v93.22,39.62
  Bottom 0.254: 84.96,47.02 C44.1 | C42.1 84.85,49.57 | 65,58.41 64.77,58.41 JP2.1
  Bottom 0.762: IC2.3 91.69,43 91.69,40.64 | 91.69,40.64 91.44,40.39 84.33,40.39 84.07,40.64 84.07,45.21 84.96,46.1 C44.1 C42.1 84.45,50.04 74.93,50.04 73.41,51.56 73.41,53.85 72.14,55.12 65.02,55.12 64.77,55.37 JP2.1 | v93.22,39.62 91.69,40.39 91.69,40.64
GND  (via drill 0.61)
  Top 0.254: C39.2 19.05,7.51 16.54,7.51 R22.1 | C41.2 16.54,16.38 19.05,16.38 R27.1 | C15.2 17.75,30.37 15.24,30.37 R12.1 | C20.2 17.75,36.69 R16.1 | IC1.11 49.38,49.53 50.06,48.84 C16.2 50.18,48.73 50.18,46.48 50.29,46.37 C11.2 50.41,46.33 57.95,46.33 60.24,44.04 R18.1 | 74.4,37.87 75.7,37.87 75.74,37.83 75.86,37.83 U$1.30 | 74.4,37.87 66.37,37.87 U$1.7 66.26,37.87 65.27,37.87 64.92,38.21 64.16,38.21 62.6,36.65 62.6,32.54 62.67,32.46 | 74.4,37.87 74.4,35.75 74.79,35.36 75.86,35.36 U$1.25 75.93,35.24 75.93,34.67 v76.09,34.52 | 74.4,37.87 74.4,38.96 74.79,39.36 75.86,39.36 U$1.33 | C24.2 54.63,27.43 C22.2 57.26,27.47 57.68,27.47 62.67,32.46 | 62.67,32.46 65.57,35.36 66.33,35.36 U$1.12 | 87.67,16 87.67,16.54 C36.1 C37.1 87.52,20.23 v86.22,21.53 | C28.1 68.47,48.92 68.47,51.44 C30.1 68.35,51.51 66.18,51.51 64.88,52.81 C33.1 62.26,52.84 C32.1 | 73.38,42.79 73.38,42.82 U$1.38 | 73.38,42.79 73.38,41.76 73.11,41.49 71.63,41.49 71.4,41.72 71.4,42.82 U$1.42 | 73.38,42.79 73.76,42.79 U$1.37 | C29.1 76.2,51.59 78.72,51.59 C31.1
  Bottom 0.254: C1.2 38.25,50.79 38.94,50.79 41.68,48.04 C25.1 | C27.2 56.54,43.97 59.05,43.97 C26.1 | C45.2 90.03,47.02 87.78,47.02 C44.2 87.74,46.86 | 87.63,49.72 87.71,49.64 C42.2 | C48.2 63.51,16.65 66.67,19.81 IC3.1 66.79,19.85 IC3.2 68.05,19.85 69.19,19.85 IC3.3 69.34,19.85 IC3.4 70.52,19.96 70.52,28.61 72.43,30.52 72.43,31.09 | 72.43,34.52 72.43,38.67 C21.1 | 72.43,34.52 72.43,31.09 | v86.22,21.53 83.21,21.53 73.65,31.09 72.43,31.09 | 72.43,34.52 v76.09,34.52
  Bottom 0.762: C44.2 87.15,46.38 IC2.1
  other vias: 76.71,42.42 74.93,43.43 54.36,19.56 57.91,15.49 60.45,12.95 62.48,18.8 64.52,20.83 59.69,23.11 61.47,26.67 59.94,31.75 50.8,23.62 50.8,14.99 54.61,13.46 57.4,5.84 46.99,5.84 26.67,4.06 26.67,12.45 26.92,23.11 17.53,23.37 18.54,13.21 12.7,5.59 21.84,29.72 21.34,36.32 21.34,42.93 21.34,49.78 21.34,55.88 3.56,24.64 2.29,2.54 2.29,59.69 11.43,59.18 20.57,59.18 38.86,59.18 92.2,60.2 87.88,52.83 75.95,54.36 80.01,54.1 81.03,42.93 83.82,53.34 79.76,35.31 78.49,32.26 78.49,28.96 83.06,28.7 78.49,22.61 69.34,22.61 78.74,10.41 81.53,10.16 89.92,9.14 90.68,27.18 72.64,27.43 67.31,29.72 76.2,6.1 35.31,44.45 40.64,52.07 66.29,48.77 47.5,35.31 52.32,35.81 39.62,30.48 39.88,3.05 72.14,36.83 46.23,51.82 46.99,49.02 45.72,44.2 40.64,41.4 30.99,39.37 29.46,42.42 29.21,55.88
  pour Bottom: 0.64,0.64 0.64,61.59 93.98,61.59 93.98,0.64
  pour Top: 1.27,60.96 1.27,1.27 93.98,1.27 93.98,60.96
  pour Route15: 0.76,0.51 94.23,0.51 arc90 94.49,0.76 94.49,14.48 94.49,61.47 1.02,61.47 arc90 0.76,61.21
  pour Route2: 0.76,0.51 94.23,0.51 arc90 94.49,0.76 94.49,3.3 94.49,61.47 1.02,61.47 arc90 0.76,61.21
MP0  (via drill 0.61)
  Top 0.254: v64.66,35.66 64.85,35.85 66.33,35.85 U$1.11
  Route2 0.254: v64.66,35.66 64.66,36.27 65.49,37.11 65.49,45.76 63.75,47.5 63.75,54.88 67.28,58.41 JP2.2
MP1  (via drill 0.61)
  Top 0.254: v66.14,34.52 67.13,34.52 67.83,35.22 67.83,36.12 67.47,36.35 U$1.10
  Route2 0.254: v66.14,34.52 66.14,45.26 69.84,48.96 69.84,58.41 JP2.3
MP2  (via drill 0.61)
  Top 0.254: v77.61,37.64 77.34,37.38 75.89,37.38 U$1.29
  Route15 0.254: v77.61,37.64 77.61,44.08 78.56,45.03 78.56,58.9 77.95,59.51 73.46,59.51 72.39,58.45 JP2.4
MP3  (via drill 0.61)
  Top 0.254: v78.64,38.67 78.64,37.45 77.99,36.8 77.23,36.8 77.19,36.84 75.89,36.84 U$1.28
  Route2 0.254: 74.94,58.45 JP2.5 74.93,59.18 75.44,59.69 80.77,59.69 81.28,59.18 81.28,45.72 78.64,43.08 v78.64,38.67
MP4  (via drill 0.61)
  Top 0.254: v64.54,37.38 66.33,37.38 U$1.8
  Route15 0.254: v64.54,37.38 70.26,37.38 77.46,44.58 77.46,58.41 JP2.6
MP5  (via drill 0.61)
  Top 0.254: v63.44,34.44 63.44,35.66 64.28,36.5 64.88,36.5 65.23,36.84 66.33,36.84 U$1.9
  Route2 0.254: v63.44,34.44 64.28,33.6 66.48,33.6 78.18,45.3 78.18,56.58 80.01,58.41 JP2.7
MP6  (via drill 0.61)
  Top 0.254: v69.38,31.13 69.38,33.34 U$1.15
  Route2 0.254: v69.38,31.13 74.07,31.13 82.53,39.59 82.53,58.41 JP2.8
MP7  (via drill 0.61)
  Top 0.254: v68.12,31.62 68.24,31.62 68.85,32.23 68.85,33.34 U$1.14
  Route15 0.254: v68.12,31.62 68.66,31.62 73.84,36.8 77.99,36.8 85.08,43.89 85.08,58.41 JP2.9
MP8  (via drill 0.61)
  Top 0.254: v80.05,33.41 77.11,36.35 75.89,36.35 U$1.27
  Route2 0.254: v80.05,33.41 80.05,8.84 85.08,3.81 JP1.9
MP9
  Top 0.254: U$1.26 75.89,35.85 76.96,35.85 77.23,35.59 77.23,18.59 76.24,17.6 76.24,10.1 82.53,3.81 JP1.8
MP10  (via drill 0.61)
  Top 0.254: v65.88,31.13 65.88,32.42 68.29,34.84 69.61,34.84 69.88,34.44 69.88,33.38 U$1.16
  Route15 0.254: v65.88,31.13 65.88,17.95 JP1.7
MP11  (via drill 0.61)
  Top 0.254: v73.53,28.77 71.36,30.94 71.36,33.34 U$1.19
  Bottom 0.254: v73.53,28.77 77.46,24.84 77.46,3.81 JP1.6
N$1
  Top 0.254: C8.2 25.91,44.46 25.91,46.98 C9.2 25.79,47.02 23.66,47.02 R7.1
N$2
  Top 0.254: C3.2 25.91,50.83 C4.2 R3.1
N$3
  Top 0.254: R3.2 18.44,53.34 C5.1 18.4,53.49 R4.2 15.81,53.38 15.81,53.53 12.15,49.87 12.15,45 10.25,43.09 X2.5
N$4
  Bottom 0.254: R1.2 31.89,52.69 31.89,50.83 C2.1 31.97,50.71 32.23,50.44 32.23,47.62 R2.1 | R1.2
N$5  (via drill 0.61)
  Top 0.254: v33.91,50.79 38.02,50.79 IC1.3
  Bottom 0.254: R2.2 35.09,47.62 35.09,49.3 35.4,49.61 35.4,50.79 C1.1 35.28,50.79 v33.91,50.79
N$6  (via drill 0.61)
  Top 0.254: IC1.2 38.06,52.08 38.06,53.34 IC1.1 37.95,53.26 31.62,53.26 30.56,52.2 v30.44,52.16 28.73,52.16 | 28.73,52.16 28.73,53.34 C4.1 | 28.73,52.16 28.73,50.83 C3.1
  Bottom 0.254: v30.44,52.16 29.11,50.83 C2.2
N$7  (via drill 0.61)
  Top 0.254: R7.2 20.8,47.02 18.48,47.02 C10.1 R8.2 15.81,47.24 15.3,47.26 v14.12,48.44
  Route2 0.254: v14.12,48.44 12.68,48.44 10.55,50.56 X2.3
N$8
  Top 0.254: R6.1 35.4,41.91 35.28,41.8 33.03,41.8 C7.1 33.64,41.68 33.64,38.9 R5.2
N$9  (via drill 0.61)
  Top 0.254: R6.2 38.59,41.57 38.59,38.1 C6.1 | R6.2 | v40.27,46.63 38.67,48.23 38.06,48.23 IC1.5 | v40.27,44.01 38.29,42.02 R6.2
  Route2 0.254: v40.27,44.01 v40.27,46.63
N$10
  Top 0.254: IC1.6 38.06,46.98 38.06,45.72 IC1.7 37.95,45.64 34.1,45.64 33.11,44.65 C7.2 32.99,44.58 28.84,44.58 C8.1 28.73,44.46 28.73,46.98 C9.1
N$11
  Top 0.254: C13.2 25.3,30.48 25.3,32.99 C14.2 25.15,33.03 23.01,33.03 R11.1
N$12
  Top 0.254: R12.2 15.24,33.15 17.75,33.15 C15.1 17.83,33.03 20.16,33.03 R11.2 | 15.16,33.26 R12.2 | R12.2 15.24,33.02 13.34,33.02 10.79,30.48 X3.5
  Route2 0.254: X3.5
N$13
  Top 0.254: C12.1 45.87,41.26 48.77,41.26 48.88,41.15 R10.1 49,41.03 49.38,40.65 51.89,40.65 R9.2
N$14
  Top 0.254: R10.2 48.88,43.97 47.51,45.34 47.51,46.33 C11.1 47.4,46.41 45.57,48.23 43.24,48.23 IC1.10
N$15
  Top 0.254: C13.1 28.08,32.99 C14.1 28.19,33.03 38.52,33.03 43.05,37.57 43.05,41.15 C12.2 43.05,41.3 43.05,45.57 43.2,45.72 IC1.8 43.24,45.83 43.24,46.98 IC1.9
N$16
  Top 0.254: C19.2 25.3,36.84 25.3,39.36 C18.2 25.15,39.4 23.01,39.4 R15.1
N$17
  Top 0.254: R15.2 20.16,39.4 17.83,39.4 C20.1 17.75,39.51 R16.2 15.13,39.47 11.85,39.47 10.25,37.87 X3.3
N$18
  Top 0.254: C17.1 46.37,56.66 49.53,56.66 R14.1 49.64,56.62 50.37,55.89 54.45,55.89 R13.2
N$19
  Top 0.254: R14.2 49.53,53.8 50.14,53.19 50.14,51.59 C16.1 50.02,51.55 49.3,50.83 43.24,50.83 IC1.12
N$20
  Top 0.254: C19.1 28.08,36.84 28.08,39.36 C18.1 28.19,39.4 28.46,39.4 32.5,43.43 38.37,43.43 41.8,46.86 41.8,51.24 43.13,52.58 43.24,52.58 | C17.2 46.33,53.84 43.74,53.84 IC1.14 43.24,53.23 43.24,52.58 | 43.24,52.58 43.24,52.08 IC1.13
N$21
  Top 0.254: R18.2 60.35,41.11 62.29,41.11 63.55,39.85 66.33,39.85 U$1.3
N$22  (via drill 0.61)
  Top 0.254: C24.1 54.63,24.65 C22.1 57.26,24.69 63.51,24.69 65.46,26.63 T1.C 65.61,26.67 65.61,29.64 67.28,31.32 67.28,32.27 67.67,32.65 | 67.67,32.65 68.35,33.34 U$1.13 | v74.71,32.99 74.37,33.34 73.88,33.34 U$1.24 | v67.55,32.77 67.67,32.65
  Route2 0.254: v74.71,32.99 67.78,32.99 v67.55,32.77
N$23
  Top 0.254: R17.1 70.03,25.72 T1.B 67.74,25.83 66.71,26.86 66.71,28.23 66.94,28.46 67.93,28.46 70.37,30.9 70.37,33.34 U$1.17
N$24  (via drill 0.61)
  Top 0.254: U$1.46 69.37,44.17 68.33,45.21 67.82,45.21 v67.69,45.34
  Route15 0.254: v34.16,56.01 41.27,56.01 43.94,58.67 59.69,58.67 62.74,55.63 65.79,55.63 67.82,53.59 67.82,45.47 v67.69,45.34
  Bottom 0.254: R1.1 34.14,56.03 v34.16,56.01
N$25  (via drill 0.61)
  Top 0.254: v35.28,36.08 33.68,36.08 R5.1 | U$1.45 69.84,42.86 69.84,44.46 67.31,46.99 66.4,46.99 v66.33,47.05
  Route15 0.254: v66.33,47.05 55.94,47.05 45.09,36.2 35.4,36.2 v35.28,36.08
N$26  (via drill 0.61)
  Top 0.254: v57.72,39.7 56.81,40.62 54.79,40.62 R9.1 | v75.84,44.44 75.84,42.96 73.91,41.03 71.09,41.03 70.37,41.76 70.37,42.82 U$1.44
  Route15 0.254: v57.72,39.7 70.14,39.7 74.62,44.44 v75.84,44.44
N$27
  Top 0.254: R13.1 57.38,55.78 57.38,55.32 61.49,51.21 65.84,51.21 67.21,49.84 67.21,47.78 68.58,46.41 68.81,46.41 70.87,44.35 70.87,42.98 U$1.43
N$28
  Top 0.254: C32.2 62.26,50.02 64.77,50.02 C33.2 64.81,49.91 64.81,45.45 65.95,44.31 68.5,44.31 68.85,43.97 68.85,42.86 U$1.47
N$29
  Top 0.254: C37.2 87.63,23.01 83.4,23.01 82.56,23.85 Q1.1 82.45,23.96 81.42,24.99 81.42,37.76 79.21,39.97 78.07,39.97 76.96,38.86 75.89,38.86 U$1.32
N$30  (via drill 0.61)
  Top 0.254: C31.2 78.72,48.77 C29.2 76.09,48.73 75.13,48.41 v74.35,48.41 | v71.44,46.52 71.44,44.39 71.86,43.97 71.86,42.86 U$1.41
  Route2 0.254: v74.35,48.41 v71.44,46.52
N$31
  Top 0.254: C30.2 71.28,51.44 71.28,48.92 C28.2 71.28,48.77 72.28,47.78 72.28,44.2 72.35,44.12 72.35,42.86 U$1.40
N$32
  Top 0.254: C34.2 83.21,32.88 C35.2 83.13,32.99 81.88,34.25 81.88,37.95 79.4,40.42 77.88,40.42 77.8,40.35 75.89,40.35 U$1.35
N$33
  Top 0.254: C34.1 85.72,37.99 85.84,38.1 R20.1
N$34
  Top 0.254: C36.2 87.63,13.87 82.91,13.87 Q1.2 82.79,13.83 77.5,13.83 R21.1
N$35
  Top 0.254: R21.2 77.5,16.69 77.5,18.21 80.89,21.6 80.89,37.64 79.02,39.51 78.26,39.51 77.08,38.33 75.89,38.33 U$1.31
N$36
  Top 0.254: S1.4 R23.1
N$37
  Top 0.254: C50.1 21.49,7.62 21.49,10.13 C38.1 21.34,10.21 19.13,10.21 C39.1 16.54,10.29 R22.2 | 16.42,10.4 R22.2 | R22.2 16.35,10.32 14.92,8.89 10.32,8.89 X1.5
  Route2 0.254: 10.25,8.8 X1.5
N$38
  Top 0.254: C38.2 24.27,10.13 C50.2 24.38,8.31 29.87,8.31 S1.7 | S1.8 30.02,5.71 30.02,8.23 S1.7 | S1.7 30.02,8.38 30.02,10.78 S1.6 30.02,10.9 30.02,13.34 S1.5
N$39
  Top 0.254: R24.1 41.76,10.82 38.59,10.82 S1.3
N$40
  Top 0.254: R25.1 S1.2
N$41
  Top 0.254: S1.1 R26.1
N$42  (via drill 0.61)
  Top 0.254: R26.2 44.62,5.71 44.62,8.23 R25.2 44.62,8.38 44.62,10.78 R24.2 44.62,10.9 44.62,13.34 R23.2 44.73,13.46 v46.74,13.46 | U$1.2 65.06,40.35 v64.26,41.15
  Route2 0.254: v46.74,13.46 46.99,13.72 46.99,23.88 v64.26,41.15
N$44
  Top 0.254: C40.1 22.75,16.54 22.75,19.05 C49.1 22.63,19.13 19.13,19.13 R27.2 | R27.2 16.54,19.2 C41.1 16.38,19.16 13.53,16.31 10.25,16.31 X1.3 | R27.2
N$45
  Top 0.254: 25.57,17.79 25.57,19.05 C49.2 | 25.57,17.79 25.57,16.54 C40.2 | S2.5 30.02,25.38 30.02,22.97 S2.6 30.02,22.86 30.02,20.42 S2.7 30.02,20.31 30.02,17.79 S2.8 29.87,17.79 25.57,17.79
N$46
  Top 0.254: R28.1 41.76,25.41 38.59,25.41 S2.4
N$47
  Top 0.254: S2.3 R29.1
N$48
  Top 0.254: R30.1 41.76,20.34 38.59,20.34 S2.2
N$49
  Top 0.254: R31.1 41.76,17.79 38.59,17.79 S2.1
N$50
  Top 0.254: R31.2 44.62,17.79 44.62,20.31 R30.2 44.62,20.42 44.62,22.86 R29.2 44.62,22.97 44.62,25.38 R28.2 44.73,25.41 58.67,39.36 66.33,39.36 U$1.4
NRST  (via drill 0.61)
  Top 0.254: U$1.5 66.33,38.86 63.86,38.86 52.87,27.88 52.87,18.5 52.86,18.41 v58.1,13.18
  Bottom 0.254: JP1.1 63.66,4.92 59.7,4.92 R19.1 59.69,5.08 58.1,6.67 v58.1,13.18
SCL  (via drill 0.61)
  Top 0.254: 73.46,32.19 73.38,32.27 73.38,33.34 U$1.23 | 71.93,23.74 v71.94,23.74 72,23.74 75.18,26.92 75.18,30.47 73.46,32.19 | 73.46,32.19 73.47,32.19
  Route15 0.254: v71.94,23.74 72.03,23.74 71.82,23.7 v71.82,15.81
  Bottom 0.254: JP1.4 72.2,3.81 70.29,5.71 70.29,6.74 69.95,7.09 69.95,8 69.99,8.04 69.99,8.88 R32.1 69.99,8.99 69.99,9.68 68.85,10.82 68.85,11.93 69.23,12.31 69.23,13.07 IC3.6 69.23,14.02 69.19,14.06 69.19,16 69.38,16.19 71.78,16.19 71.82,16.15 v71.82,15.81
SDA  (via drill 0.61)
  Top 0.254: v74.03,27.05 74.37,27.39 74.37,30.37 72.89,31.85 72.89,33.34 U$1.22
  Bottom 0.254: R33.1 73.65,13.79 71.09,13.79 IC3.5 | v74.03,27.05 74.03,18.48 74.91,17.6 74.91,15.05 73.76,13.91 R33.1 | JP1.5 74.91,3.81 74.91,12.46 73.69,13.68 R33.1
WB  (via drill 0.61)
  Top 0.254: v73.27,30.25 71.89,31.62 71.89,33.34 U$1.20
  Route2 0.254: v73.27,30.25 73.27,29.72 67.32,23.77 67.32,3.81 JP1.2
WP
  Top 0.254: U$1.21 72.39,33.38 72.39,34.44 72.66,34.84 74.09,34.84 75.78,33.15 75.78,9.72 69.88,3.81 JP1.3
  Bottom 0.254: IC3.7 67.97,13.14 67.97,10.25 68.85,9.37 68.85,4.8 69.84,3.81 JP1.3